# EasyEDA schematic Prática-09.json
TITLE: Sheet_1; REV: 1.0; Date: 2020-10-27; Sheet: 1/1; Company: Your Company
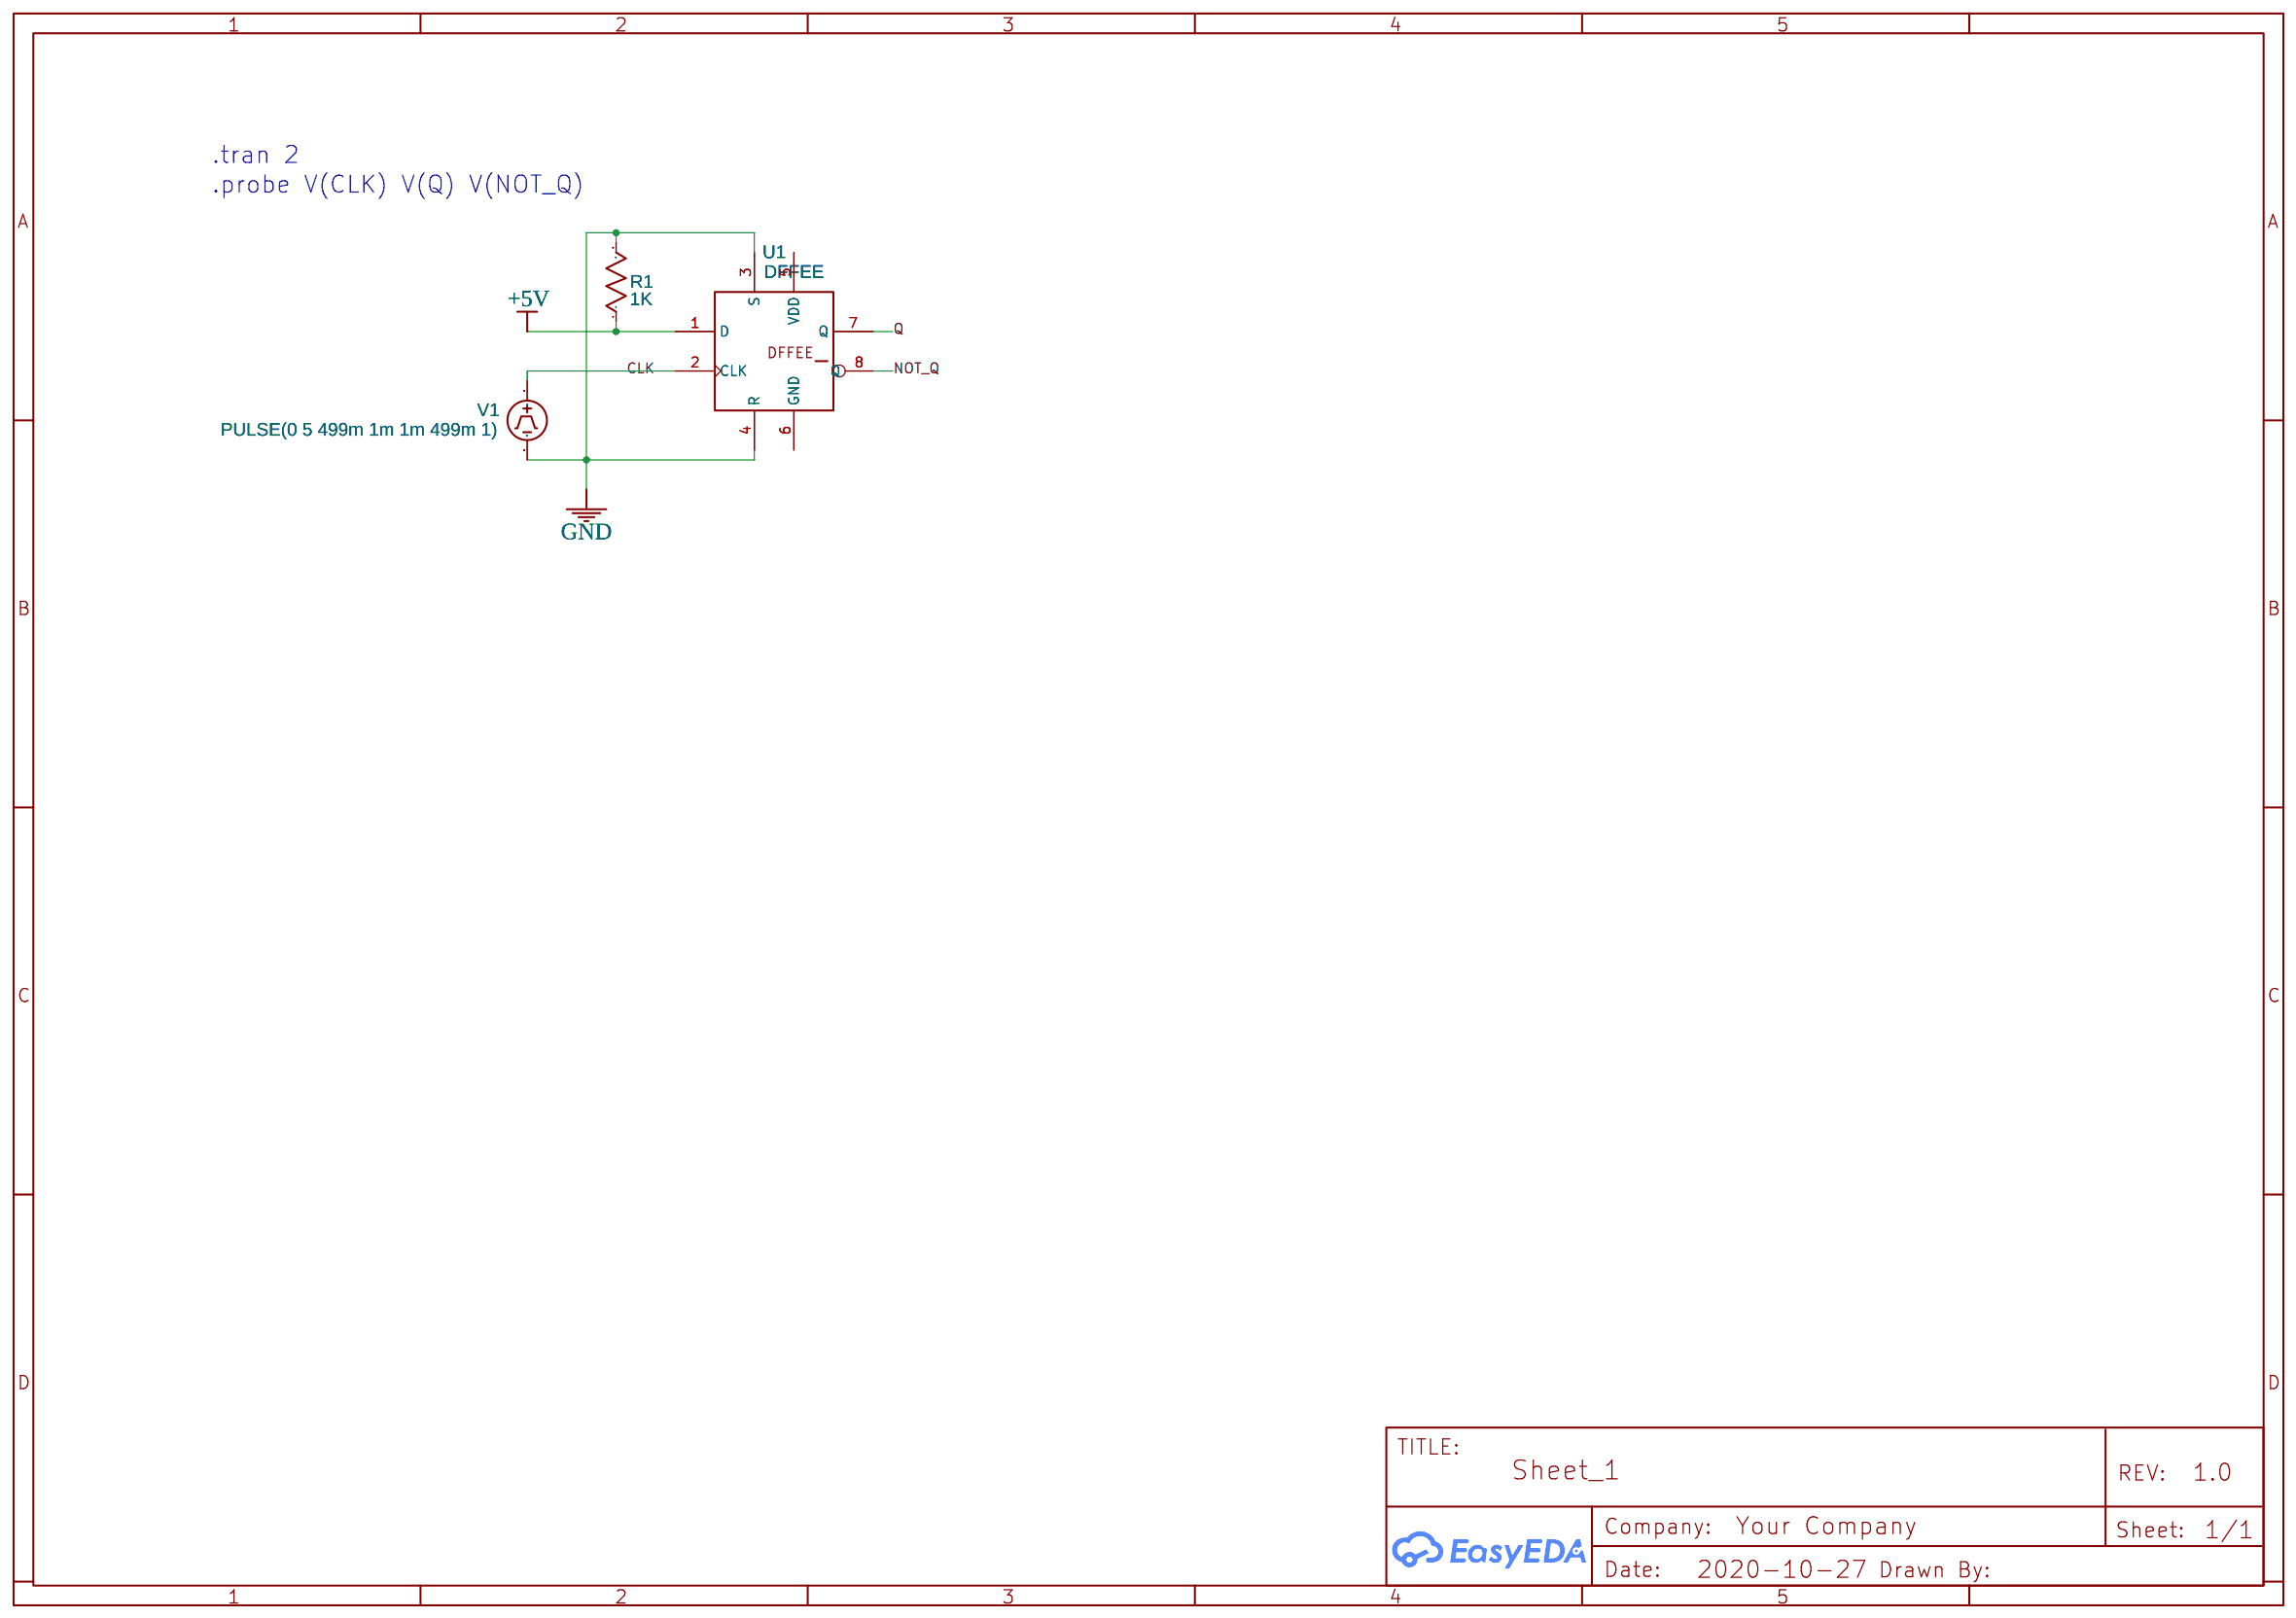
[diagram p0: schematic sheet]

## Parts
R1  1K  [AXIAL-0.3]
U1  DFFEE
V1  PULSE(0 5 499m 1m 1m 499m 1)  [HDR1X2]

## Library data of the parts
R1 = Resistor_US: Resistance: 1k; Contributor: EasyEDA; Supplier: YUJING
U1 = LOGIC: Contributor: EasyEDA; Supplier: YUJING
V1 = VPULSE: Contributor: EasyEDA; sim: true

## Nets
+5V: R1.1 U1.1(D)
GND: R1.2 U1.3(S) U1.4(R) V1.2
CLK: U1.2(CLK) V1.1
NOT_Q: U1.8(Q)
Q: U1.7(Q)

Not connected (* = marked no-connect by the designer): U1 5(VDD) 6(GND)

## Notes on the sheet
- .tran 2
- .probe V(CLK) V(Q) V(NOT_Q)
